# Altium project COBAND.PrjPcb
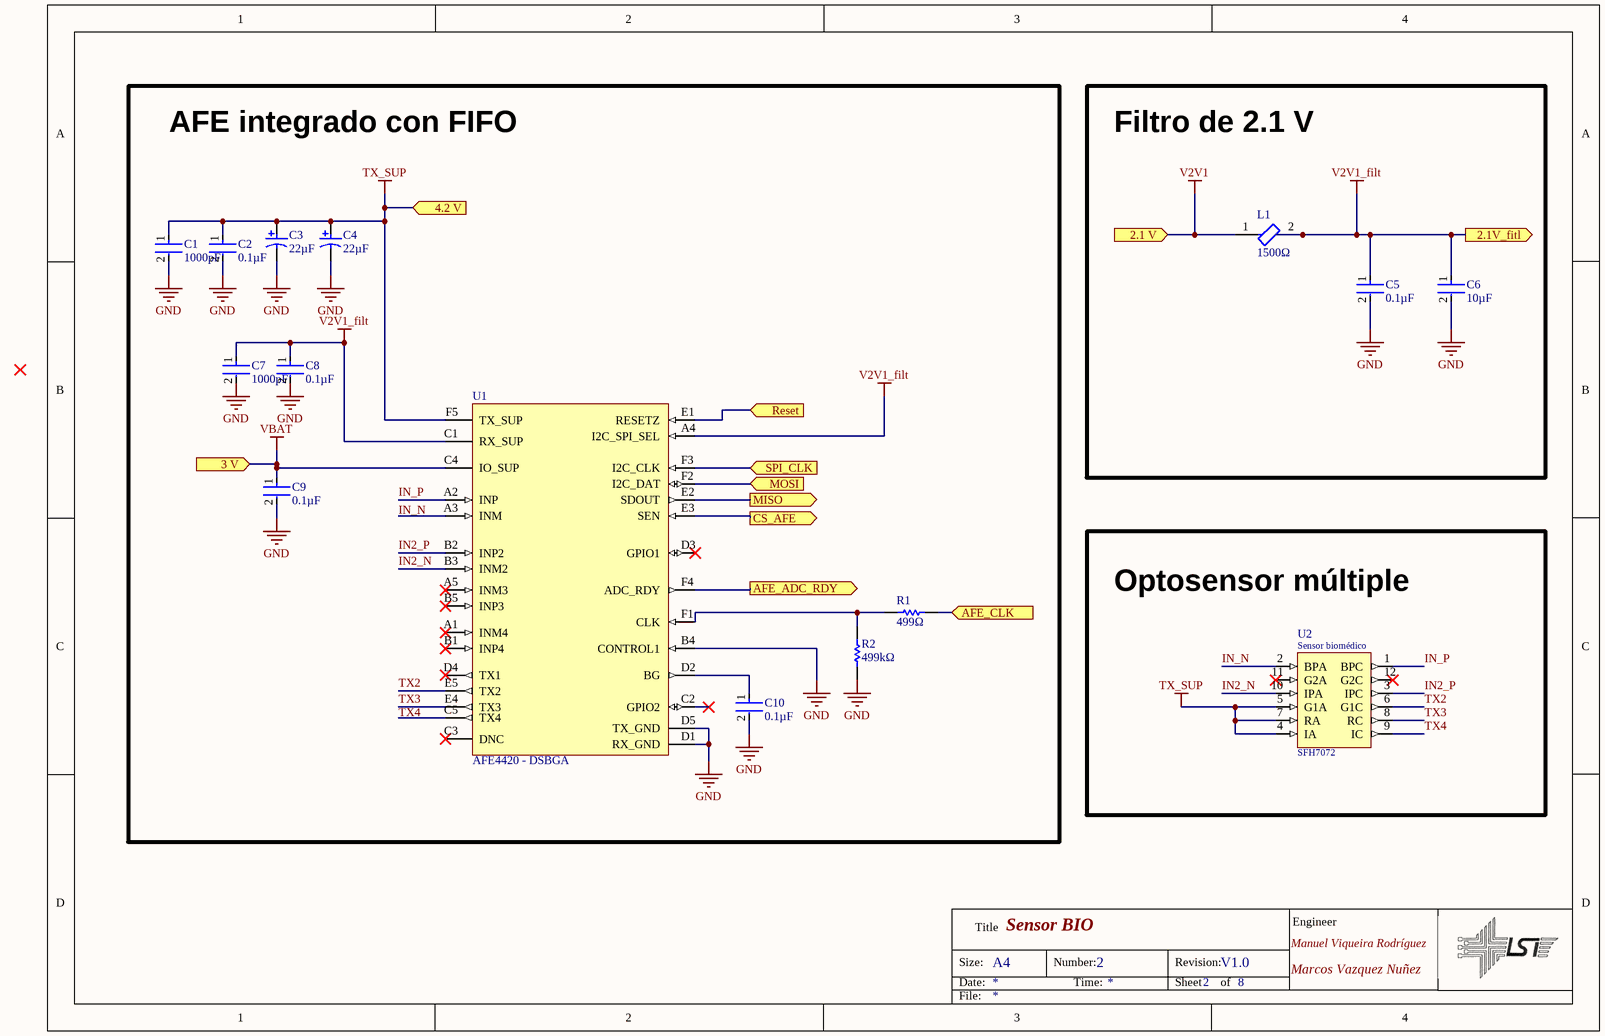
[diagram p0: AFE4220.SchDoc]
3 sheets, 42 parts. Net scope: flat (ports and power ports of the same name join across sheets).
Board file: testDEOP.PcbDoc
Sheets:
  AFE4220.SchDoc
  CC2640.SchDoc
  Actuadores.SchDoc

## Sheet AFE4220.SchDoc: Sensor BIO
size A4; CompanyName: MUISE; Engineer: Manuel Viqueira Rodríguez; Organization: ETSI Telecomunicaciones; Address1: Av. Complutense, 30; Address2: , 28040 Madrid; Address3: Madrid; Address4: España; DocumentNumber: 2; Revision: V1.0; SheetNumber: 2; SheetTotal: 8; Engineer2: Marcos Vazquez Nuñez

### Parts
C1  1000pF  [FP-CL10-IPC_B]
C2  0.1µF  [FP-CL10-IPC_B]
C3  22µF  [NIC-CAPA2-4X5.8_V]
C4  22µF  [NIC-CAPA2-4X5.8_V]
C5  0.1µF  [FP-CL10-IPC_B]
C6  10µF  [FP-CL10-IPC_B]
C7  1000pF  [FP-CL10-IPC_B]
C8  0.1µF  [FP-CL10-IPC_B]
C9  0.1µF  [FP-CL10-IPC_B]
C10  0.1µF  [FP-CL10-IPC_B]
L1  1500Ω  [FP-BLM18-0_15-t0_8-IPC_C]
R1  499Ω  [RESC0603X28X15ML05T05]
R2  499kΩ  [RESC0603X28X15ML05T05]
U1  AFE4420 - DSBGA  [AFE4420 - DSBGA]
U2  (no value)  [SFH7072]

### Blocks framed on the sheet
AFE integrado con FIFO: C1-C4 C7-C10 R1 R2 U1
Filtro de 2.1 V: C5 C6 L1
Optosensor múltiple: U2

### Ports
2.1 V (in), 2.1V_fitl (out), 3 V (in), 4.2 V (in), AFE_ADC_RDY (out), AFE_CLK (in), CS_AFE (out), MISO (out), MOSI (in), Reset (in), SPI_CLK (in)

### Nets
GND: C1.2 C2.2 C3.2 C4.2 C5.2 C6.2 C7.2 C8.2 C9.2 C10.2 R2.1 U1.B4(CONTROL1) U1.D1(RX_GND) U1.D5(TX_GND)
TX_SUP: C1.1 C2.1 C3.1 C4.1 U1.F5(TX_SUP) U2.4(IA) U2.5(G1A) U2.7(RA) ; port 4.2 V
V2V1: L1.1 ; port 2.1 V
V2V1_filt: C5.1 C6.1 C7.1 C8.1 L1.2 U1.A4(I2C_SPI_SEL) U1.C1(RX_SUP) ; port 2.1V_fitl
VBAT: C9.1 U1.C4(IO_SUP) ; port 3 V
IN2_N: U1.B3(INM2) U2.10(IPA)
IN2_P: U1.B2(INP2) U2.3(IPC)
IN_N: U2.2(BPA)
IN_P: U1.A2(INP) U2.1(BPC)
TX2: U1.E5(TX2) U2.6(G1C)
TX3: U1.E4(TX3) U2.8(RC)
TX4: U2.9(IC)
NetC10_1: C10.1 U1.D2(BG)
NetR1_1: R1.1 R2.2 U1.F1(CLK)
NetR1_2: R1.2 ; port AFE_CLK
NetU1_E1: U1.E1(RESETZ) ; port Reset
NetU1_E2: U1.E2(SDOUT) ; port MISO
NetU1_E3: U1.E3(SEN) ; port CS_AFE
NetU1_F2: U1.F2(I2C_DAT) ; port MOSI
NetU1_F3: U1.F3(I2C_CLK) ; port SPI_CLK
NetU1_F4: U1.F4(ADC_RDY) ; port AFE_ADC_RDY

Not connected (* = marked no-connect by the designer): U1 A1(INM4)* A3(INM) A5(INM3)* B1(INP4)* B5(INP3)* C2(GPIO2)* C3(DNC)* C5(TX4) D3(GPIO1)* D4(TX1)*; U2 11(G2A)* 12(G2C)*

### Notes on the sheet
- Labels drawn without touching a wire or pin: IN_N, TX4
- Size:
- Date:
- Title
- A4
- Number:
- Time:
- Revision:
- Sheet
- of
- Engineer
- File:
- (in symbol SFH7072) Sensor biomédico

### Library data of the parts
C1 C2 C5-C10 = CMP-13271-003245-1: Cap Ceramic 10uF 10V X5R ±10% Pad SMD 0603 +85°C T/R; Packaging: Tape and Reel; Dielectric: X5R; Min Operating Temperature: -55°C; Lead Free: Lead Free; Height: 0.8mm; Package Quantity: 10000; Voltage Rating (DC): 10V; Mount: Surface Mount; Tolerance: 10%; Width: 0.031inch; Thickness: 0.035inch; Depth: 0.8mm; Max Operating Temperature: 85°C; Capacitance: 10uF; Case/Package: 0603; Length: 1.6mm; Voltage Rating: 10V; Radiation Hardening: No
C3 C4 = CMP-0687-00010-1: Aluminum Electrolytic Capacitor, UD Series, Low Impedance, 22 uF, 10 V, + / - 20%, -55 to 105 degC, Chip Type, 4 x 5.8 mm D x L, Pb-Free, Reel; Manufacturer: Nichicon; PartNumber: UUD1A220MCL1GS; Endurance Time: 2000 h; Packing: Dia382mm Reel; Tolerance Rated Capacitance: -20 to 20%; Rated Ripple Current (at 100kHz): 80 mA; Impedance: 1.8 Ohm; Rated Capacitance: 22 uF; Rated Voltage: 10 V; ComponentLink3URL: http://products.nichicon.co.jp/en/pdf/XJA043/e-ud.pdf; ComponentLink2URL: http://products.nichicon.co.jp/en/pdf/XJA043/e-ud.pdf; ComponentLink2Description: Datasheet; ComponentLink1URL: http://www.nichicon.co.jp/; DatasheetVersion: 08/2012; PackageDescription: 2-Pin Surface Mount Device, Diameter 4 mm, Height 5.8 mm, Pitch 3.6 mm; PackageReference: CAPAE-D4H5.8; ComponentLink1Description: Manufacturer URL; Length: 5.8 mm; Diameter: 4 mm; ComponentLink3Description: Package Specification; Mounting Technology: Surface Mount; RoHS: TRUE
L1 = CMP-0686-00368-3: Chip Ferrite Bead, 0603, 1500Ω @ 100MHz, 0.5Ω, 25%, 500mA; Impedance: 1.5kR; DC Resistance (DCR): 500mR; Number of Circuits: 1; Test Frequency: 100MHz; Case/Package: 0603; Max Operating Temperature: 125°C; Package Quantity: 1; Max DC Current: 500mA; Tolerance: 25%; Core Material: Ferrite; Width: 0.8mm; Number of Pins: 2; Depth: 0.8mm; Radiation Hardening: No; Case Code (Imperial): 0603; Min Operating Temperature: -55°C; Termination: SMD/SMT; Material: Ferrite; Military Standard: Not; Number of Lines: 1; DC Current: 500mA; Length: 1.6mm; REACH SVHC: No SVHC; Lead Free: Lead Free; Current Rating: 500mA; Max Current Rating: 500mA; Packaging: Tape and Reel; Case Code (Metric): 1608; Height: 0.8mm
R1 R2 = CMP-2004-00291-1: Manufacturer: Vishay Dale; Part Number: CRCW020120K0JNED
U2 = SFH7072: Sensor biométrico

## Sheet CC2640.SchDoc: Microcontrolador CC2640
size A4; CompanyName: MUISE; Engineer: Manuel Viqueira Rodríguez; Organization: ETSI Telecomunicaciones; Address1: Av. Complutense, 30; Address2: , 28040 Madrid; Address3: Madrid; Address4: España; DocumentNumber: 3; Revision: V1.0; SheetNumber: 3; SheetTotal: 8; Engineer2: Marcos Vazquez Nuñez
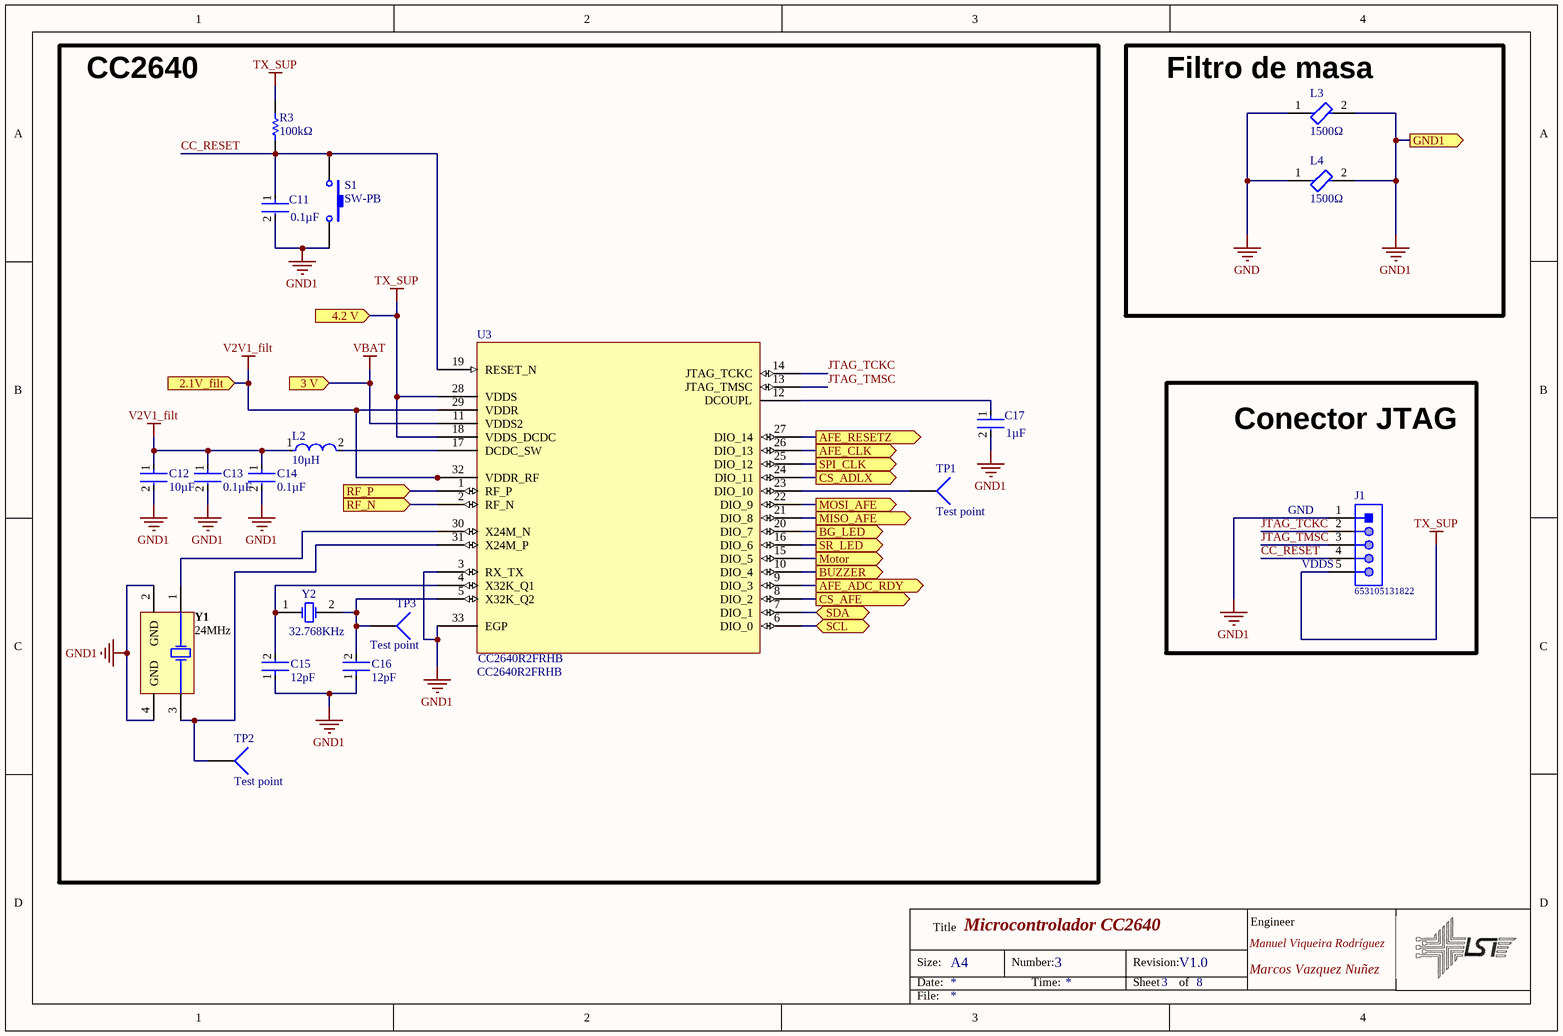
[diagram p1: CC2640.SchDoc]

### Parts
C11  0.1µF  [FP-CL10-IPC_B]
C12  10µF  [FP-CL10-IPC_B]
C13  0.1µF  [FP-CL10-IPC_B]
C14  0.1µF  [FP-CL10-IPC_B]
C15  12pF  [FP-CL10-IPC_B]
C16  12pF  [FP-CL10-IPC_B]
C17  1µF  [FP-CL10-IPC_B]
J1  653105131822  [653105131822]
L2  10µH  [FP-LQW15AN_00-W0_6-0_1-MFG]
L3  1500Ω  [FP-BLM18-0_15-t0_8-IPC_C]
L4  1500Ω  [FP-BLM18-0_15-t0_8-IPC_C]
R3  100kΩ  [RESC0603X28X15ML05T05]
S1  SW-PB  [SPST-2]
TP1  Test point  [PIN1]
TP2  Test point  [PIN1]
TP3  Test point  [PIN1]
U3  CC2640R2FRHB  [DEOP2021-Calle-Payno]
Y1  24MHz  [ABRA-ABM3B-4_V]
Y2  32.768KHz  [R38]

### Blocks framed on the sheet
CC2640: C11-C17 L2 R3 S1 TP1-TP3 U3 Y1 Y2
Filtro de masa: L3 L4
Conector JTAG: J1

### Ports
2.1V_filt (in), 3 V (in), 4.2 V (in), AFE_ADC_RDY (out), AFE_CLK (out), AFE_RESETZ (out), BG_LED (out), BUZZER (out), CS_ADLX (out), CS_AFE (out), GND1 (out), MISO_AFE (out), MOSI_AFE (out), Motor (out), RF_N (in), RF_P (in), SCL (bidir), SDA (bidir), SPI_CLK (out), SR_LED (out)

### Nets
GND: L3.1 L4.1
GND1: C11.2 C12.2 C13.2 C14.2 C15.1 C16.1 C17.2 J1.1 L3.2 L4.2 S1.2 U3.3(RX_TX) U3.33(EGP) Y1.2(GND) Y1.4(GND) ; port GND1
TX_SUP: J1.5 R3.2 U3.18(VDDS_DCDC) U3.28(VDDS) ; port 4.2 V
V2V1_filt: C12.1 C13.1 C14.1 L2.1 U3.29(VDDR) U3.32(VDDR_RF) ; port 2.1V_filt
VBAT: U3.11(VDDS2) ; port 3 V
CC_RESET: C11.1 J1.4 R3.1 S1.1 U3.19(RESET_N)
JTAG_TCKC: J1.2 U3.14(JTAG_TCKC)
JTAG_TMSC: J1.3 U3.13(JTAG_TMSC)
NetC15_2: C15.2 U3.4(X32K_Q1) Y2.1(OSC1)
NetC16_2: C16.2 TP3.1 U3.5(X32K_Q2) Y2.2(OSC2)
NetC17_1: C17.1 U3.12(DCOUPL)
NetL2_2: L2.2 U3.17(DCDC_SW)
NetR1_2: U3.26(DIO_13) ; port AFE_CLK
NetR9_1: U3.20(DIO_7) ; port BG_LED
NetR10_1: U3.16(DIO_6) ; port SR_LED
NetR11_1: U3.10(DIO_4) ; port BUZZER
NetTP1_1: TP1.1 U3.23(DIO_10)
NetTP2_1: TP2.1 U3.31(X24M_P) Y1.3(X2)
NetU1_E3: U3.8(DIO_2) ; port CS_AFE
NetU1_F3: U3.25(DIO_12) ; port SPI_CLK
NetU1_F4: U3.9(DIO_3) ; port AFE_ADC_RDY
NetU3_1: U3.1(RF_P) ; port RF_P
NetU3_2: U3.2(RF_N) ; port RF_N
NetU3_6: U3.6(DIO_0) ; port SCL
NetU3_7: U3.7(DIO_1) ; port SDA
NetU3_15: U3.15(DIO_5) ; port Motor
NetU3_21: U3.21(DIO_8) ; port MISO_AFE
NetU3_22: U3.22(DIO_9) ; port MOSI_AFE
NetU3_24: U3.24(DIO_11) ; port CS_ADLX
NetU3_27: U3.27(DIO_14) ; port AFE_RESETZ
NetU3_30: U3.30(X24M_N) Y1.1(X1)

### Notes on the sheet
- (near J1) GND
- (near J1) VDDS
- Size:
- Date:
- Title
- A4
- Number:
- Time:
- Revision:
- Sheet
- of
- Engineer
- File:

### Library data of the parts
C11-C17 = CMP-13271-003245-1: as C1 on sheet AFE4220; Packaging: Tape and Reel; Dielectric: X5R; Min Operating Temperature: -55°C; Lead Free: Lead Free; Height: 0.8mm; Package Quantity: 10000; Voltage Rating (DC): 10V; Mount: Surface Mount; Tolerance: 10%; Width: 0.031inch; Thickness: 0.035inch; Depth: 0.8mm; Max Operating Temperature: 85°C; Capacitance: 10uF; Case/Package: 0603; Length: 1.6mm; Voltage Rating: 10V; Radiation Hardening: No
J1 = CMP-1502-00774-1: Male Shrouded Header WR-WTB, SMT, Right Angled, pitch 1.25 mm, 1 x 5 position; Manufacturer: Wurth Elektronik; Contact Resistance: 20mOhm; Working Voltage: 125VAC; Position: 1x5; Pitch: 1.25mm; Datasheet URL: https://katalog.we-online.de/em/datasheet/6531xx131822.pdf; Orientation: RightAngled; Package Reference: 653105131822; Operating Temperature: -40to85degC; Gender: Male; Publisher: WurthElektronik; Mounting Technology: SMT; Packaging: TapeandReel; Manufacturer URL: http://www.we-online.de; Part Number: 653105131822
L2 = CMP-2000-06595-2: Wire Wound RF Inductor 15nH ±5% 460mA 0.16Ω 0402 (1005); Test Frequency: 100MHz; DC Resistance (DCR): 160mR; Shielding: Unshielded; Q Factor: 30; Core Material: Air; Self Resonant Frequency: 5GHz; Resistor Type: Wirewound; DC Current: 460mA; Inductance: 15nH; Weight: 2.8E-05oz; Radiation Hardening: No; Depth: 0.7mm; Package Quantity: 10000; Case/Package: 0402; Packaging: Tape and Reel; Length: 1mm; Max DC Current: 460mA; Case Code (Imperial): 0402; Tolerance: 5%; Min Operating Temperature: -55°C; Lead Free: Lead Free; Width: 0.02inch; Case Code (Metric): 1005; Termination: SMD/SMT; Military Standard: Not; Current Rating: 460mA; Height: 0.5mm; Mount: Surface Mount; Max Operating Temperature: 125°C
L3 L4 = CMP-0686-00368-3: as L1 on sheet AFE4220; Test Frequency: 100MHz; Case/Package: 0603; Max Operating Temperature: 125°C; Package Quantity: 1; Max DC Current: 500mA; Tolerance: 25%; Core Material: Ferrite; Width: 0.8mm; Number of Pins: 2; Depth: 0.8mm; Radiation Hardening: No; Case Code (Imperial): 0603; Min Operating Temperature: -55°C; Termination: SMD/SMT; Material: Ferrite; Military Standard: Not; Number of Lines: 1; DC Current: 500mA; Length: 1.6mm; REACH SVHC: No SVHC; Lead Free: Lead Free; Current Rating: 500mA; Max Current Rating: 500mA; Packaging: Tape and Reel; Case Code (Metric): 1608; Height: 0.8mm
R3 = CMP-2004-00291-1: as R1 on sheet AFE4220
S1 = SW-PB: Switch; Published: 24-Mar-1999; LatestRevisionDate: 17-Jul-2002; LatestRevisionNote: Re-released for DXP Platform.; PackageReference: SPST-2; Publisher: Altium Limited; PackageDescription: Switch; 2 Leads
TP1-TP3 = Socket: LatestRevisionDate: 17-Jul-2002; LatestRevisionNote: Re-released for DXP Platform.; Publisher: Altium Limited
Y1 = CMP-1688-00008-1: Ceramic SMD Crystal, 24 MHz, +/- 20 ppm, 50 Ohm, -20 to 70 degC, 4-Pin SMD, RoHS, Tape and Reel; Impedance: 50 Ohm; Mating Cycles: 30; Frequency: 6 Hz; Contact Material: Brass; Contact Plating: Gold; PackageReference: ABM3B; Min Operating Temperature: -40 degC; ComponentLink2Description: Datasheet; Radiation Hardening: No; DatasheetVersion: Aug-15; Packaging: Tape and Reel; Length: 2.6 mm; Package Quantity: 2500; REACH SVHC: Unknown; PackageDescription: 4-Pin Surface Mount Device, Body 5 x 3.2 mm; Weight: 0.001058 oz; ComponentLink2URL: http://www.abracon.com/Resonators/abm3b.pdf; ComponentLink1Description: Manufacturer URL; Width: 3 mm; RoHSCompliant: true; Fastening Type: Snap; Max Operating Temperature: 155 degC; ComponentLink1URL: http://www.abracon.com/; Height: 1.244 mm; Mount: Surface Mount
Y2 = XTAL: Crystal Oscillator; Published: 8-Jun-2000; LatestRevisionDate: 17-Jul-2002; LatestRevisionNote: Re-released for DXP Platform.; PackageReference: R38; Publisher: Altium Limited; PackageDescription: Crystal, Thru-Hole; 2 Leads; Body 3.1 x 8.2 mm (Dia.xH)

## Sheet Actuadores.SchDoc: Actuadores
size A4; CompanyName: MUISE; Engineer: Manuel Viqueira Rodríguez; Organization: ETSI Telecomunicaciones; Address1: Av. Complutense, 30; Address2: , 28040 Madrid; Address3: Madrid; Address4: España; DocumentNumber: 6; Revision: V1.0; SheetNumber: 6; SheetTotal: 8; Engineer2: Marcos Vázquez Núñez
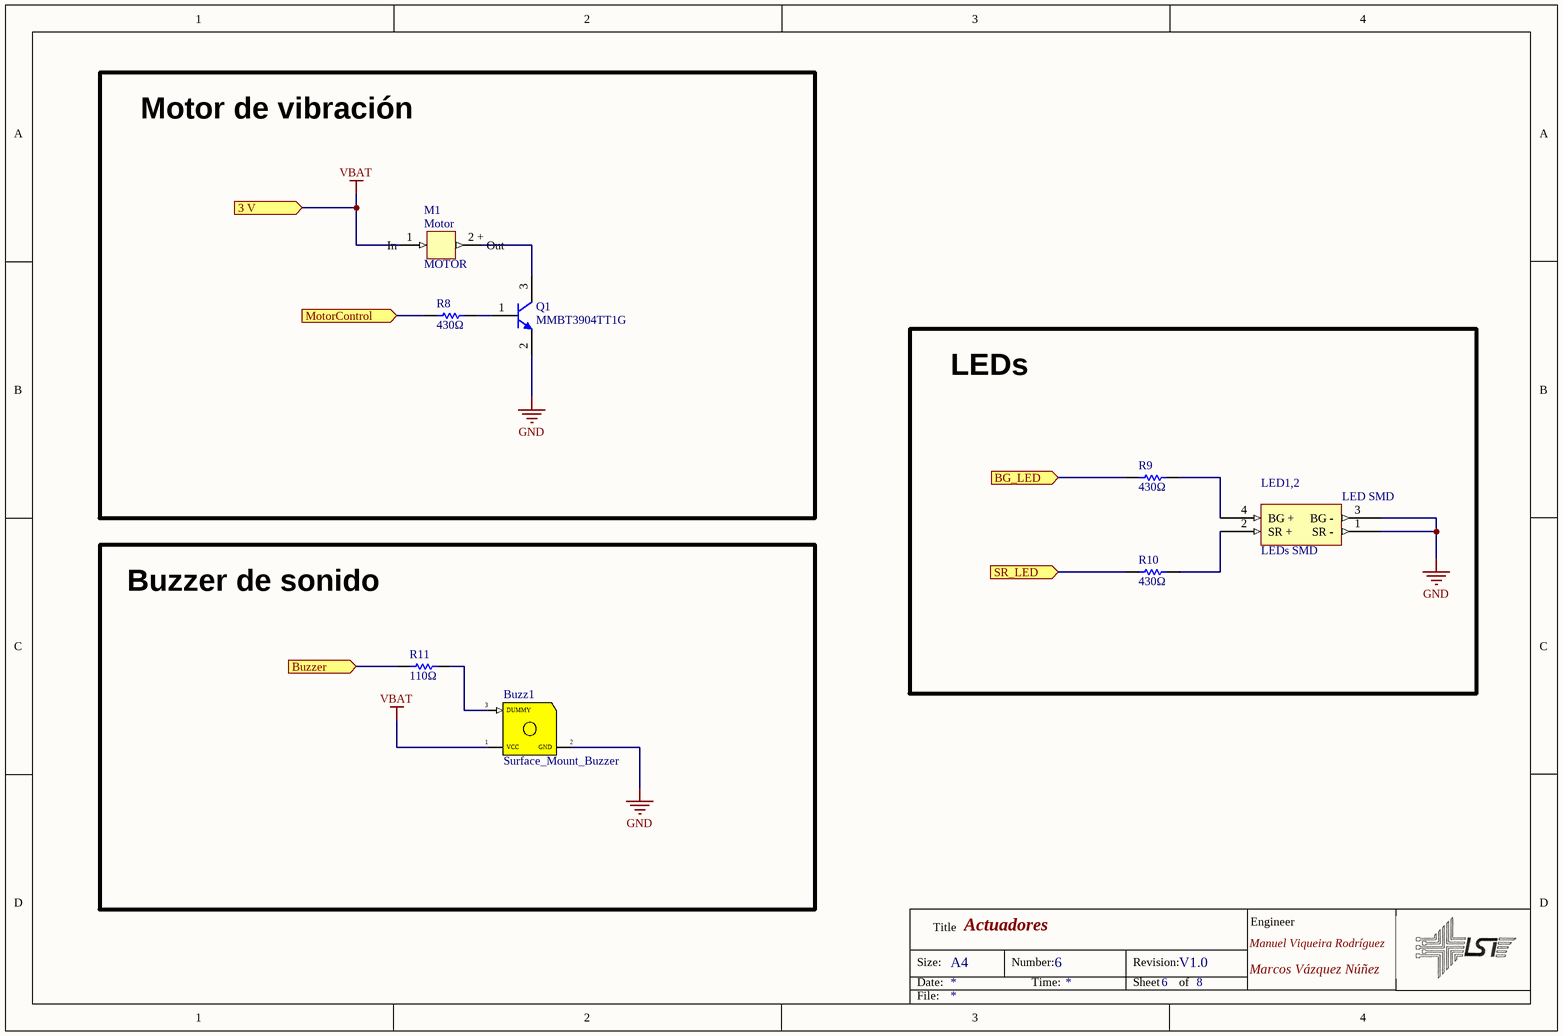
[diagram p2: Actuadores.SchDoc]

### Parts
Buzz1  Surface_Mount_Buzzer  [buzzer]
LED1,2  LEDs SMD  [LED_SMD]
M1  MOTOR  [Motor]
Q1  MMBT3904TT1G  [ONSC-SC-75-3-463-01_V]
R8  430Ω  [RESC0603X28X15ML05T05]
R9  430Ω  [RESC0603X28X15ML05T05]
R10  430Ω  [RESC0603X28X15ML05T05]
R11  110Ω  [RESC0603X28X15ML05T05]

### Blocks framed on the sheet
Motor de vibración: M1 Q1 R8
LEDs: LED1,2 R9 R10
Buzzer de sonido: Buzz1 R11

### Ports
3 V (in), BG_LED (in), Buzzer (in), MotorControl (in), SR_LED (in)

### Nets
GND: Buzz1.2(GND) LED1,2.1(SR_-) LED1,2.3(BG_-) Q1.2(E)
VBAT: Buzz1.1(VCC) M1.1(In) ; port 3 V
NetBuzz1_3: Buzz1.3(DUMMY) R11.2
NetLED1,2_2: LED1,2.2(SR_+) R10.2
NetLED1,2_4: LED1,2.4(BG_+) R9.2
NetM1_2 +: M1.2_+(Out) Q1.3(C)
NetQ1_1: Q1.1(B) R8.2
NetR8_1: R8.1 ; port MotorControl
NetR9_1: R9.1 ; port BG_LED
NetR10_1: R10.1 ; port SR_LED
NetR11_1: R11.1 ; port Buzzer

### Notes on the sheet
- Size:
- Date:
- Title
- A4
- Number:
- Time:
- Revision:
- Sheet
- of
- Engineer
- File:
- (in symbol LED) LED SMD
- (in symbol MOTOR) Motor

### Library data of the parts
LED1,2 = LED
Q1 = CMP-1048-00420-1: General Purpose Transistor, NPN Silicon, 3-Pin SC-75, Pb-Free, Tape and Reel; Manufacturer: On Semiconductor; IC Continuous (A): 0.2; fT Min (MHz): 300; ComponentLink3URL: http://www.onsemi.com/pub_link/Collateral/463-01.PDF; DatasheetVersion: Rev. 5; RoHS: TRUE; Mounting Technology: Surface Mount; ComponentLink1URL: http://www.onsemi.com/; ComponentLink3Description: Package Specification; PackageReference: SC-75-3-463-01; Polarity: NPN; ComponentLink2Description: Datasheet; PackageVersion: Rev. F, 07/2005; PartNumber: MMBT3904TT1G; ComponentLink2URL: http://www.onsemi.cn/pub_link/Collateral/MMBT3904TT1-D.PDF; ComponentLink1Description: Manufacturer URL; PackageDescription: 3-Pin Small Outline Transistor, Body 1.6 x 0.8 mm, Pitch 0.5 mm; Packing: Tape and Reel
R8-R11 = CMP-2004-00291-1: as R1 on sheet AFE4220

## Nets that join several sheets
GND: AFE4220 (14 pins), CC2640 (L3.1 L4.1), Actuadores (Buzz1.2 LED1,2.1 LED1,2.3 Q1.2)
TX_SUP: AFE4220 (8 pins), CC2640 (J1.5 R3.2 U3.18 U3.28)
V2V1_filt: AFE4220 (7 pins), CC2640 (6 pins)
VBAT: AFE4220 (C9.1 U1.C4), CC2640 (U3.11), Actuadores (Buzz1.1 M1.1)
NetR1_2: AFE4220 (R1.2), CC2640 (U3.26)
NetR9_1: CC2640 (U3.20), Actuadores (R9.1)
NetR10_1: CC2640 (U3.16), Actuadores (R10.1)
NetR11_1: CC2640 (U3.10), Actuadores (R11.1)
NetU1_E3: AFE4220 (U1.E3), CC2640 (U3.8)
NetU1_F3: AFE4220 (U1.F3), CC2640 (U3.25)
NetU1_F4: AFE4220 (U1.F4), CC2640 (U3.9)